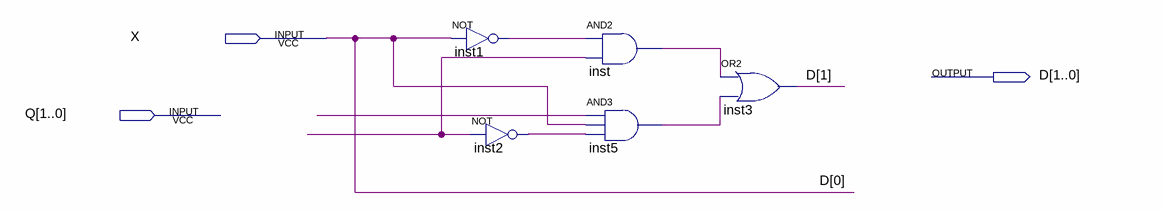
[diagram p0: schematic sheet]
// Quartus schematic NEXT_STATE.bdf as structural Verilog: 5 symbols, 3 pins
module NEXT_STATE (
  input  X,
  input  [1:0] Q,
  output [1:0] D
);

  wire inst1_out, inst2_out, inst5_out, inst_out, undriven, undriven_2;

  not inst1 (inst1_out, X);
  not inst2 (inst2_out, undriven);
  and inst (inst_out, inst1_out, undriven);
  and inst5 (inst5_out, undriven_2, X, inst2_out);
  or inst3 (D[1], inst_out, inst5_out);

  assign D[0] = X;
endmodule
